# Altium schematic sheet S7CAS-PLEIADES-CARTE-MERE_P06_DDR3.SCHDOC
size Tabloid; SheetNumber: 12; SheetTotal: 18; Sheet_Name: DDR3; Size: 11x17
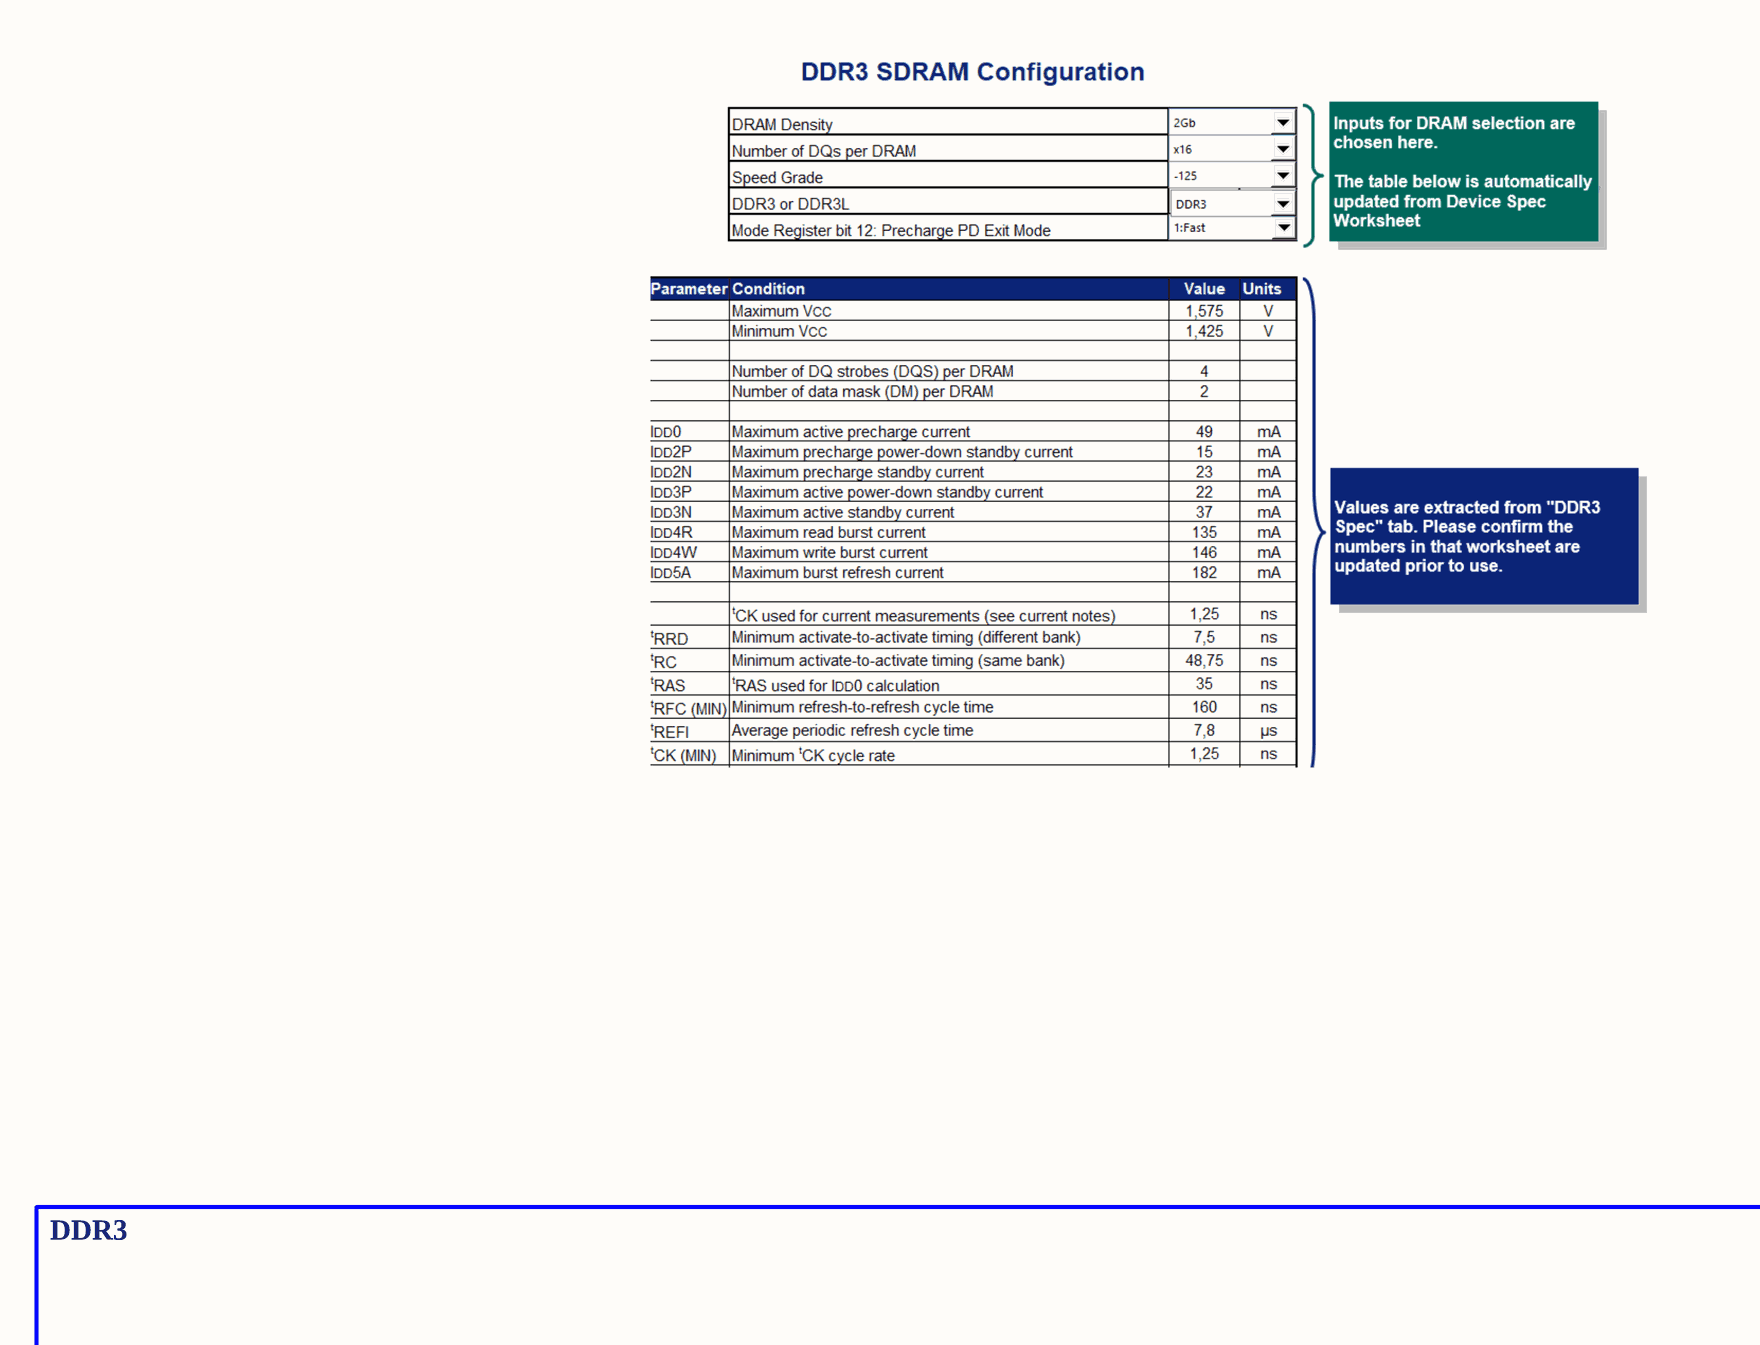
[diagram p0: S7CAS-PLEIADES-CARTE-MERE_P06_DDR3.SCHDOC, top left]
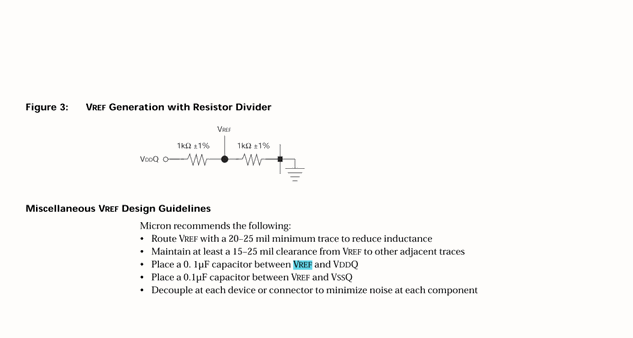
[diagram p1: S7CAS-PLEIADES-CARTE-MERE_P06_DDR3.SCHDOC, top right]
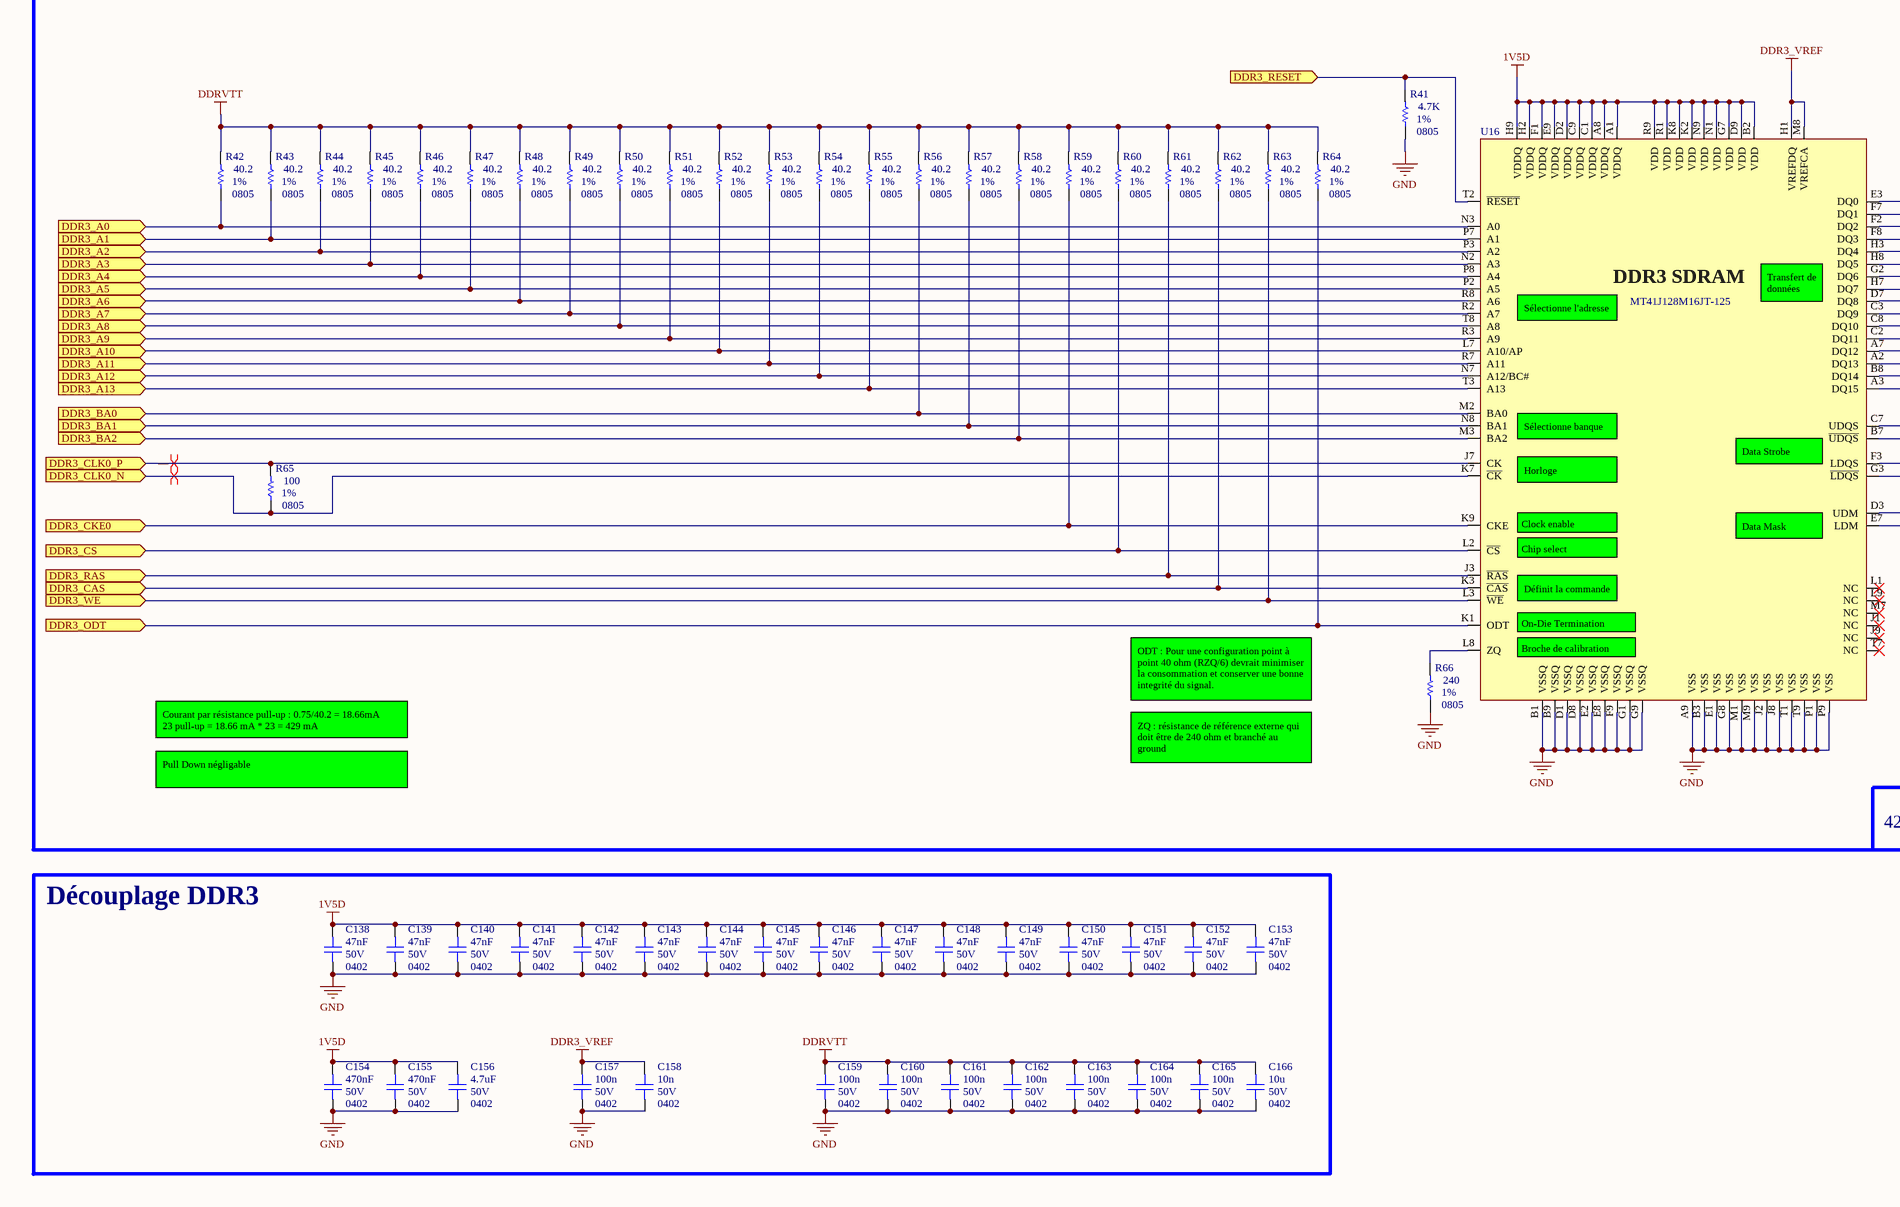
[diagram p2: S7CAS-PLEIADES-CARTE-MERE_P06_DDR3.SCHDOC, bottom left]
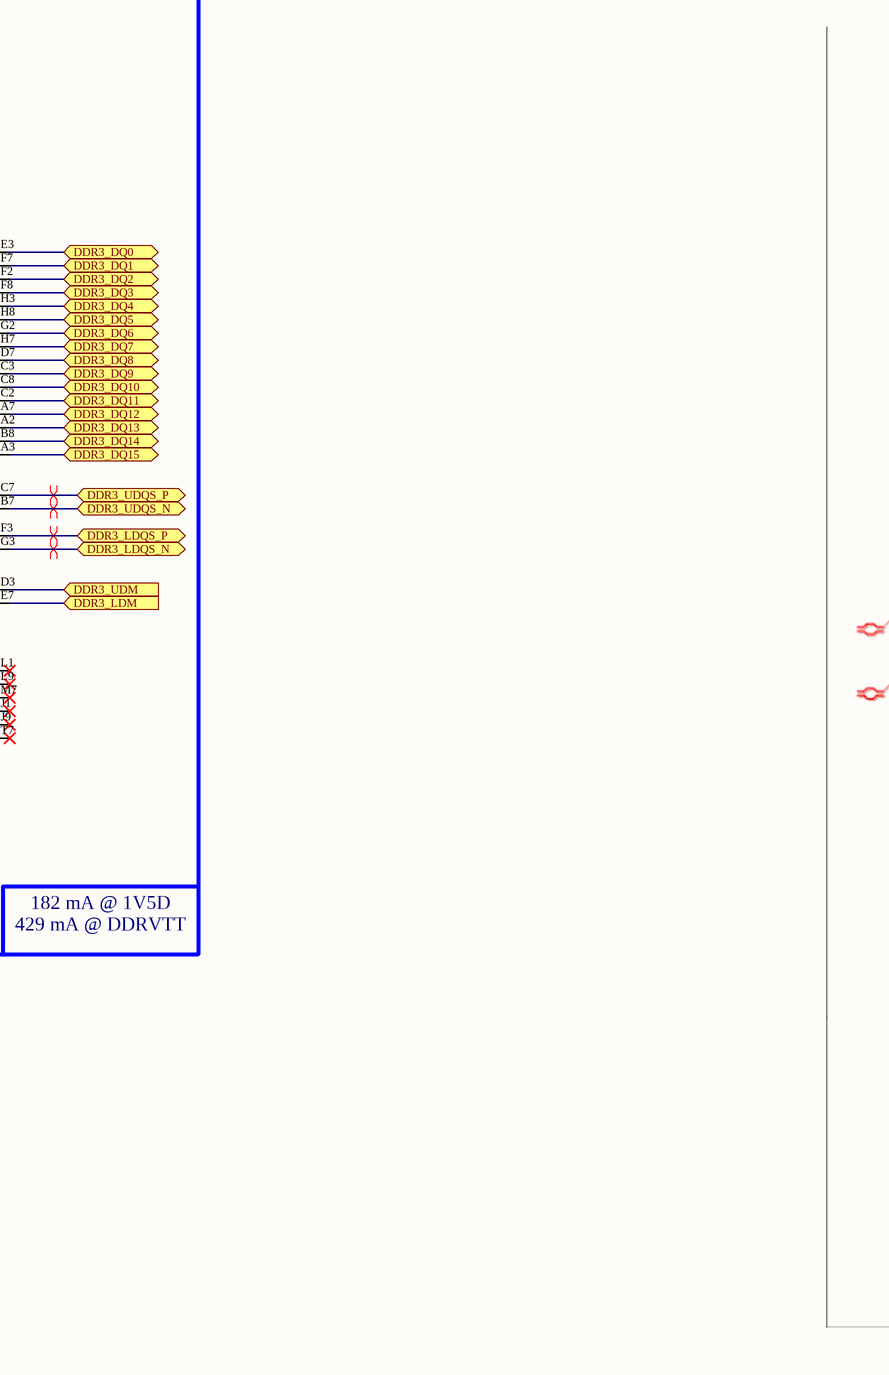
[diagram p3: S7CAS-PLEIADES-CARTE-MERE_P06_DDR3.SCHDOC, bottom middle]
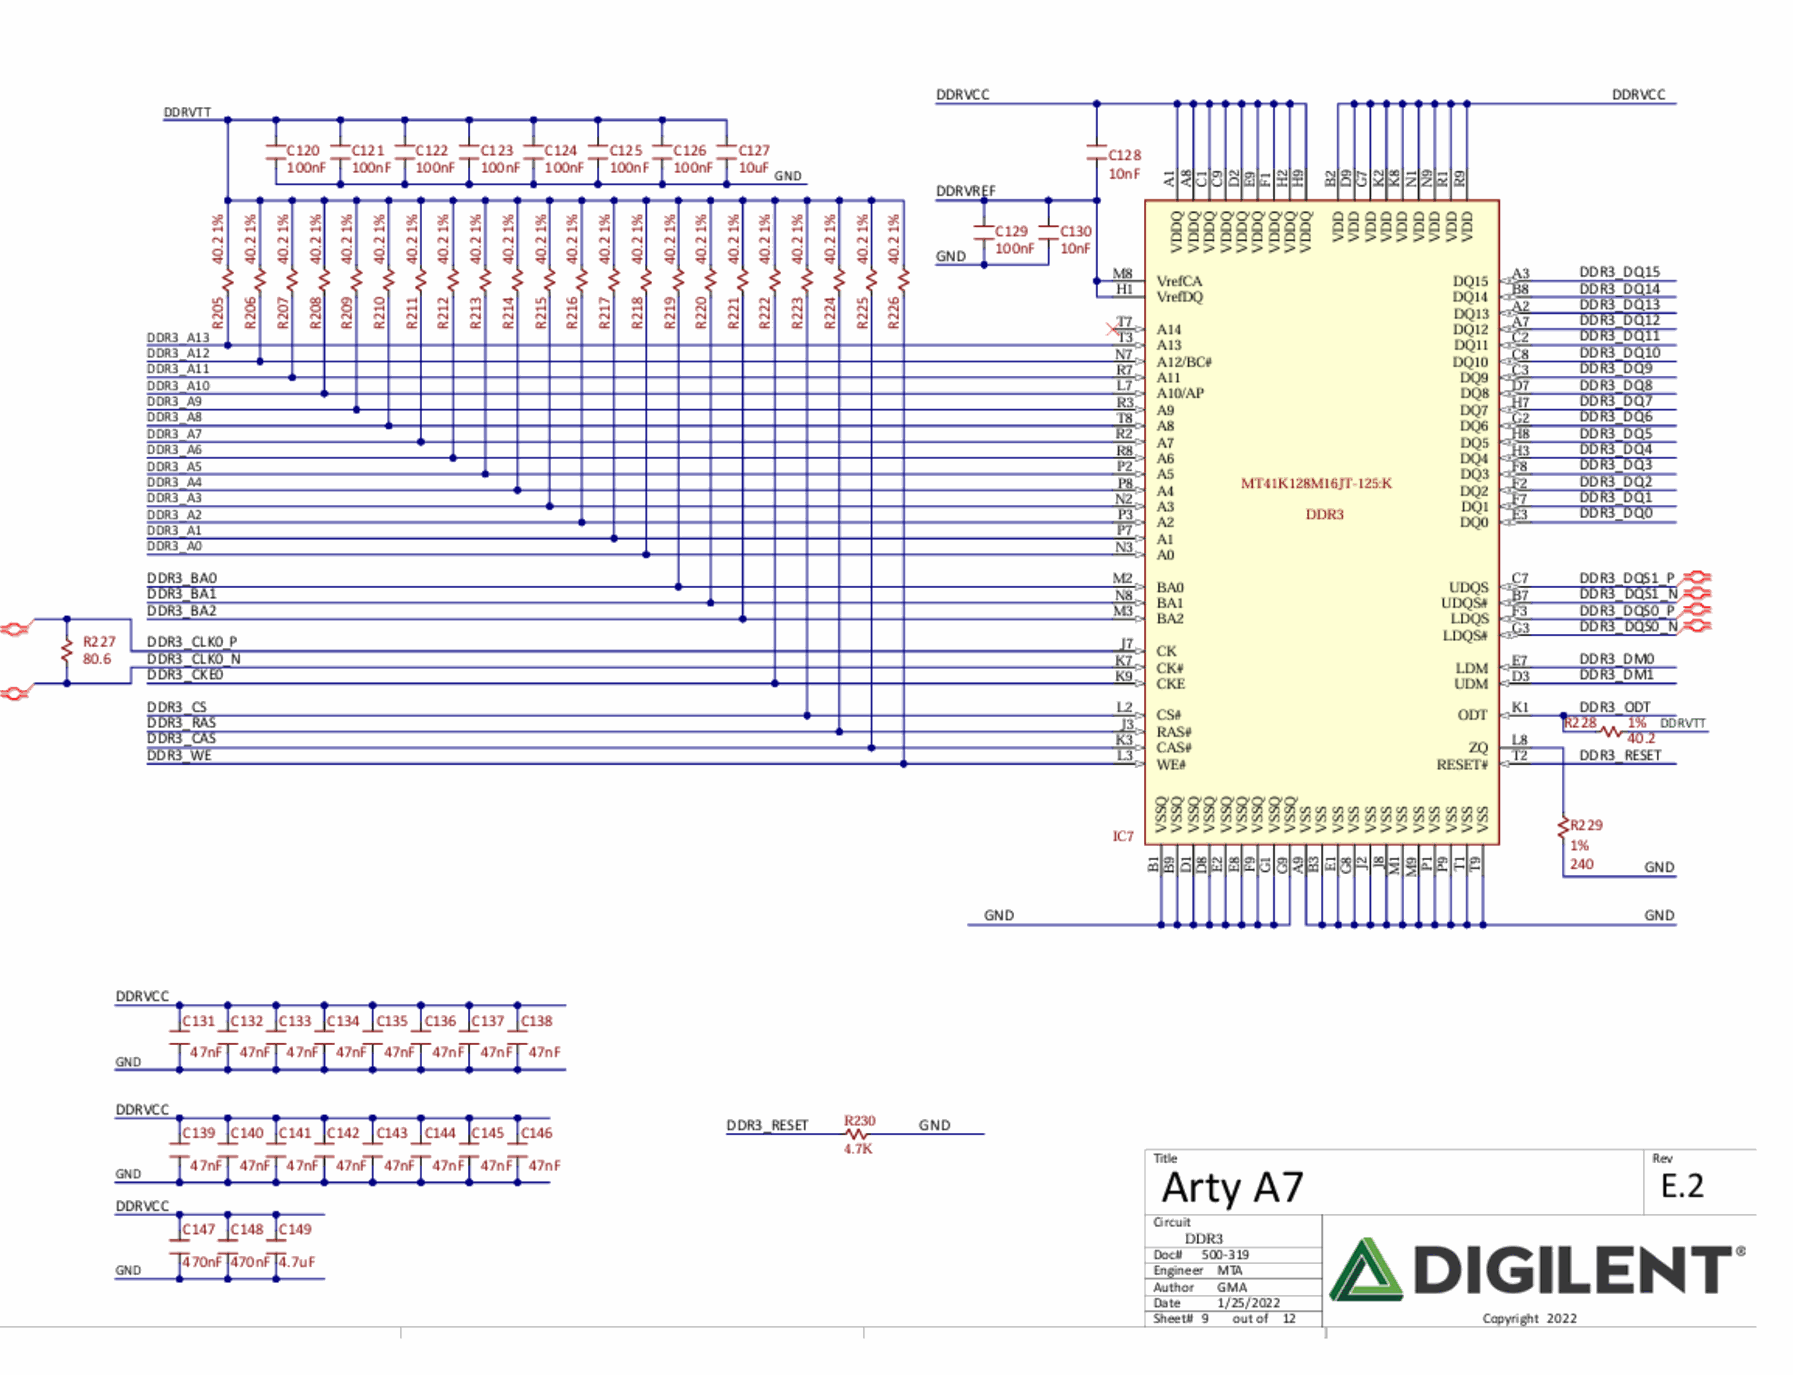
[diagram p4: S7CAS-PLEIADES-CARTE-MERE_P06_DDR3.SCHDOC, bottom right]

## Parts
C138  value 47nF  Voltage: 50V  Package: 0402  [CAP_0402]  (hidden comment: CAP - 0402)
C139  value 47nF  Voltage: 50V  Package: 0402  [CAP_0402]  (hidden comment: CAP - 0402)
C140  value 47nF  Voltage: 50V  Package: 0402  [CAP_0402]  (hidden comment: CAP - 0402)
C141  value 47nF  Voltage: 50V  Package: 0402  [CAP_0402]  (hidden comment: CAP - 0402)
C142  value 47nF  Voltage: 50V  Package: 0402  [CAP_0402]  (hidden comment: CAP - 0402)
C143  value 47nF  Voltage: 50V  Package: 0402  [CAP_0402]  (hidden comment: CAP - 0402)
C144  value 47nF  Voltage: 50V  Package: 0402  [CAP_0402]  (hidden comment: CAP - 0402)
C145  value 47nF  Voltage: 50V  Package: 0402  [CAP_0402]  (hidden comment: CAP - 0402)
C146  value 47nF  Voltage: 50V  Package: 0402  [CAP_0402]  (hidden comment: CAP - 0402)
C147  value 47nF  Voltage: 50V  Package: 0402  [CAP_0402]  (hidden comment: CAP - 0402)
C148  value 47nF  Voltage: 50V  Package: 0402  [CAP_0402]  (hidden comment: CAP - 0402)
C149  value 47nF  Voltage: 50V  Package: 0402  [CAP_0402]  (hidden comment: CAP - 0402)
C150  value 47nF  Voltage: 50V  Package: 0402  [CAP_0402]  (hidden comment: CAP - 0402)
C151  value 47nF  Voltage: 50V  Package: 0402  [CAP_0402]  (hidden comment: CAP - 0402)
C152  value 47nF  Voltage: 50V  Package: 0402  [CAP_0402]  (hidden comment: CAP - 0402)
C153  value 47nF  Voltage: 50V  Package: 0402  [CAP_0402]  (hidden comment: CAP - 0402)
C154  value 470nF  Voltage: 50V  Package: 0402  [CAP_0402]  (hidden comment: CAP - 0402)
C155  value 470nF  Voltage: 50V  Package: 0402  [CAP_0402]  (hidden comment: CAP - 0402)
C156  value 4.7uF  Voltage: 50V  Package: 0402  [CAP_0402]  (hidden comment: CAP - 0402)
C157  value 100n  Voltage: 50V  Package: 0402  [CAP_0402]  (hidden comment: CAP - 0402)
C158  value 10n  Voltage: 50V  Package: 0402  [CAP_0402]  (hidden comment: CAP - 0402)
C159  value 100n  Voltage: 50V  Package: 0402  [CAP_0402]  (hidden comment: CAP - 0402)
C160  value 100n  Voltage: 50V  Package: 0402  [CAP_0402]  (hidden comment: CAP - 0402)
C161  value 100n  Voltage: 50V  Package: 0402  [CAP_0402]  (hidden comment: CAP - 0402)
C162  value 100n  Voltage: 50V  Package: 0402  [CAP_0402]  (hidden comment: CAP - 0402)
C163  value 100n  Voltage: 50V  Package: 0402  [CAP_0402]  (hidden comment: CAP - 0402)
C164  value 100n  Voltage: 50V  Package: 0402  [CAP_0402]  (hidden comment: CAP - 0402)
C165  value 100n  Voltage: 50V  Package: 0402  [CAP_0402]  (hidden comment: CAP - 0402)
C166  value 10u  Voltage: 50V  Package: 0402  [CAP_0402]  (hidden comment: CAP - 0402)
R41  value 4.7K  Package: 0805  Precision: 1%  [RES_0805]  (hidden comment: RES - 0805)
R42  value 40.2  Package: 0805  Precision: 1%  [RES_0805]  (hidden comment: RES - 0805)
R43  value 40.2  Package: 0805  Precision: 1%  [RES_0805]  (hidden comment: RES - 0805)
R44  value 40.2  Package: 0805  Precision: 1%  [RES_0805]  (hidden comment: RES - 0805)
R45  value 40.2  Package: 0805  Precision: 1%  [RES_0805]  (hidden comment: RES - 0805)
R46  value 40.2  Package: 0805  Precision: 1%  [RES_0805]  (hidden comment: RES - 0805)
R47  value 40.2  Package: 0805  Precision: 1%  [RES_0805]  (hidden comment: RES - 0805)
R48  value 40.2  Package: 0805  Precision: 1%  [RES_0805]  (hidden comment: RES - 0805)
R49  value 40.2  Package: 0805  Precision: 1%  [RES_0805]  (hidden comment: RES - 0805)
R50  value 40.2  Package: 0805  Precision: 1%  [RES_0805]  (hidden comment: RES - 0805)
R51  value 40.2  Package: 0805  Precision: 1%  [RES_0805]  (hidden comment: RES - 0805)
R52  value 40.2  Package: 0805  Precision: 1%  [RES_0805]  (hidden comment: RES - 0805)
R53  value 40.2  Package: 0805  Precision: 1%  [RES_0805]  (hidden comment: RES - 0805)
R54  value 40.2  Package: 0805  Precision: 1%  [RES_0805]  (hidden comment: RES - 0805)
R55  value 40.2  Package: 0805  Precision: 1%  [RES_0805]  (hidden comment: RES - 0805)
R56  value 40.2  Package: 0805  Precision: 1%  [RES_0805]  (hidden comment: RES - 0805)
R57  value 40.2  Package: 0805  Precision: 1%  [RES_0805]  (hidden comment: RES - 0805)
R58  value 40.2  Package: 0805  Precision: 1%  [RES_0805]  (hidden comment: RES - 0805)
R59  value 40.2  Package: 0805  Precision: 1%  [RES_0805]  (hidden comment: RES - 0805)
R60  value 40.2  Package: 0805  Precision: 1%  [RES_0805]  (hidden comment: RES - 0805)
R61  value 40.2  Package: 0805  Precision: 1%  [RES_0805]  (hidden comment: RES - 0805)
R62  value 40.2  Package: 0805  Precision: 1%  [RES_0805]  (hidden comment: RES - 0805)
R63  value 40.2  Package: 0805  Precision: 1%  [RES_0805]  (hidden comment: RES - 0805)
R64  value 40.2  Package: 0805  Precision: 1%  [RES_0805]  (hidden comment: RES - 0805)
R65  value 100  Package: 0805  Precision: 1%  [RES_0805]  (hidden comment: RES - 0805)
R66  value 240  Package: 0805  Precision: 1%  [RES_0805]  (hidden comment: RES - 0805)
U16  MT41J128M16JT-125  [MEM_DDR3_MT41J128M16JT-125]

## Blocks framed on the sheet
DDR3: R41-R66 U16
Découplage DDR3: C138-C166

## Ports
DDR3_A0 (in, see S7CAS-PLEIADES-CARTE-MERE_P06_FPGA2[6B]), DDR3_A1 (in, see S7CAS-PLEIADES-CARTE-MERE_P06_FPGA2[6B]), DDR3_A2 (in, see S7CAS-PLEIADES-CARTE-MERE_P06_FPGA2[6B]), DDR3_A3 (in, see S7CAS-PLEIADES-CARTE-MERE_P06_FPGA2[6B]), DDR3_A4 (in, see S7CAS-PLEIADES-CARTE-MERE_P06_FPGA2[6B]), DDR3_A5 (in, see S7CAS-PLEIADES-CARTE-MERE_P06_FPGA2[6B]), DDR3_A6 (in, see S7CAS-PLEIADES-CARTE-MERE_P06_FPGA2[6B]), DDR3_A7 (in, see S7CAS-PLEIADES-CARTE-MERE_P06_FPGA2[6B]), DDR3_A8 (in, see S7CAS-PLEIADES-CARTE-MERE_P06_FPGA2[6B]), DDR3_A9 (in, see S7CAS-PLEIADES-CARTE-MERE_P06_FPGA2[6B]), DDR3_A10 (in, see S7CAS-PLEIADES-CARTE-MERE_P06_FPGA2[6B]), DDR3_A11 (in, see S7CAS-PLEIADES-CARTE-MERE_P06_FPGA2[6C]), DDR3_A12 (in, see S7CAS-PLEIADES-CARTE-MERE_P06_FPGA2[6C]), DDR3_A13 (in, see S7CAS-PLEIADES-CARTE-MERE_P06_FPGA2[6C]), DDR3_BA0 (in, see S7CAS-PLEIADES-CARTE-MERE_P06_FPGA2[6B]), DDR3_BA1 (in, see S7CAS-PLEIADES-CARTE-MERE_P06_FPGA2[6B]), DDR3_BA2 (in, see S7CAS-PLEIADES-CARTE-MERE_P06_FPGA2[6B]), DDR3_CAS (in, see S7CAS-PLEIADES-CARTE-MERE_P06_FPGA2[6B]), DDR3_CKE0 (in, see S7CAS-PLEIADES-CARTE-MERE_P06_FPGA2[6B]), DDR3_CLK0_N (in, see S7CAS-PLEIADES-CARTE-MERE_P06_FPGA2[6B]), DDR3_CLK0_P (in, see S7CAS-PLEIADES-CARTE-MERE_P06_FPGA2[6B]), DDR3_CS (in, see S7CAS-PLEIADES-CARTE-MERE_P06_FPGA2[6C]), DDR3_DQ0 (bidir, see S7CAS-PLEIADES-CARTE-MERE_P06_FPGA2[6A]), DDR3_DQ1 (bidir, see S7CAS-PLEIADES-CARTE-MERE_P06_FPGA2[6A]), DDR3_DQ2 (bidir, see S7CAS-PLEIADES-CARTE-MERE_P06_FPGA2[6A]), DDR3_DQ3 (bidir, see S7CAS-PLEIADES-CARTE-MERE_P06_FPGA2[6A]), DDR3_DQ4 (bidir, see S7CAS-PLEIADES-CARTE-MERE_P06_FPGA2[6B]), DDR3_DQ5 (bidir, see S7CAS-PLEIADES-CARTE-MERE_P06_FPGA2[6B]), DDR3_DQ6 (bidir, see S7CAS-PLEIADES-CARTE-MERE_P06_FPGA2[6B]), DDR3_DQ7 (bidir, see S7CAS-PLEIADES-CARTE-MERE_P06_FPGA2[6B]), DDR3_DQ8 (bidir, see S7CAS-PLEIADES-CARTE-MERE_P06_FPGA2[6A]), DDR3_DQ9 (bidir, see S7CAS-PLEIADES-CARTE-MERE_P06_FPGA2[6A]), DDR3_DQ10 (bidir, see S7CAS-PLEIADES-CARTE-MERE_P06_FPGA2[6A]), DDR3_DQ11 (bidir, see S7CAS-PLEIADES-CARTE-MERE_P06_FPGA2[6A]), DDR3_DQ12 (bidir, see S7CAS-PLEIADES-CARTE-MERE_P06_FPGA2[6A]), DDR3_DQ13 (bidir, see S7CAS-PLEIADES-CARTE-MERE_P06_FPGA2[6A]), DDR3_DQ14 (bidir, see S7CAS-PLEIADES-CARTE-MERE_P06_FPGA2[4C]), DDR3_DQ15 (bidir, see S7CAS-PLEIADES-CARTE-MERE_P06_FPGA2[6A]), DDR3_LDM (in, see S7CAS-PLEIADES-CARTE-MERE_P06_FPGA2[6B]), DDR3_LDQS_N (bidir, see S7CAS-PLEIADES-CARTE-MERE_P06_FPGA2[6B]), DDR3_LDQS_P (bidir, see S7CAS-PLEIADES-CARTE-MERE_P06_FPGA2[6A]), DDR3_ODT (in, see S7CAS-PLEIADES-CARTE-MERE_P06_FPGA2[6B]), DDR3_RAS (in, see S7CAS-PLEIADES-CARTE-MERE_P06_FPGA2[6B]), DDR3_RESET (in, see S7CAS-PLEIADES-CARTE-MERE_P06_FPGA2[6C]), DDR3_UDM (in, see S7CAS-PLEIADES-CARTE-MERE_P06_FPGA2[6B]), DDR3_UDQS_N (bidir, see S7CAS-PLEIADES-CARTE-MERE_P06_FPGA2[6A]), DDR3_UDQS_P (bidir, see S7CAS-PLEIADES-CARTE-MERE_P06_FPGA2[6A]), DDR3_WE (in, see S7CAS-PLEIADES-CARTE-MERE_P06_FPGA2[6B])

## Nets
1V5D: C138.2 C139.2 C140.2 C141.2 C142.2 C143.2 C144.2 C145.2 C146.2 C147.2 C148.2 C149.2 C150.2 C151.2 C152.2 C153.2 C154.2 C155.2 C156.2 U16.A1(VDDQ) U16.A8(VDDQ) U16.B2(VDD) U16.C1(VDDQ) U16.C9(VDDQ) U16.D2(VDDQ) U16.D9(VDD) U16.E9(VDDQ) U16.F1(VDDQ) U16.G7(VDD) U16.H2(VDDQ) U16.H9(VDDQ) U16.K2(VDD) U16.K8(VDD) U16.N1(VDD) U16.N9(VDD) U16.R1(VDD) U16.R9(VDD)
DDR3_VREF: C157.2 C158.2 U16.H1(VREFDQ) U16.M8(VREFCA)
DDRVTT: C159.2 C160.2 C161.2 C162.2 C163.2 C164.2 C165.2 C166.2 R42.2 R43.2 R44.2 R45.2 R46.2 R47.2 R48.2 R49.2 R50.2 R51.2 R52.2 R53.2 R54.2 R55.2 R56.2 R57.2 R58.2 R59.2 R60.2 R61.2 R62.2 R63.2 R64.2
GND: C138.1 C139.1 C140.1 C141.1 C142.1 C143.1 C144.1 C145.1 C146.1 C147.1 C148.1 C149.1 C150.1 C151.1 C152.1 C153.1 C154.1 C155.1 C156.1 C157.1 C158.1 C159.1 C160.1 C161.1 C162.1 C163.1 C164.1 C165.1 C166.1 R41.1 R66.1 U16.A9(VSS) U16.B1(VSSQ) U16.B3(VSS) U16.B9(VSSQ) U16.D1(VSSQ) U16.D8(VSSQ) U16.E1(VSS) U16.E2(VSSQ) U16.E8(VSSQ) U16.F9(VSSQ) U16.G1(VSSQ) U16.G8(VSS) U16.G9(VSSQ) U16.J2(VSS) U16.J8(VSS) U16.M1(VSS) U16.M9(VSS) U16.P1(VSS) U16.P9(VSS) U16.T1(VSS) U16.T9(VSS)
DDR3_A0: R42.1 U16.N3(A0) ; port DDR3_A0
DDR3_A1: R43.1 U16.P7(A1) ; port DDR3_A1
DDR3_A2: R44.1 U16.P3(A2) ; port DDR3_A2
DDR3_A3: R45.1 U16.N2(A3) ; port DDR3_A3
DDR3_A4: R46.1 U16.P8(A4) ; port DDR3_A4
DDR3_A5: R47.1 U16.P2(A5) ; port DDR3_A5
DDR3_A6: R48.1 U16.R8(A6) ; port DDR3_A6
DDR3_A7: R49.1 U16.R2(A7) ; port DDR3_A7
DDR3_A8: R50.1 U16.T8(A8) ; port DDR3_A8
DDR3_A9: R51.1 U16.R3(A9) ; port DDR3_A9
DDR3_A10: R52.1 U16.L7(A10/AP) ; port DDR3_A10
DDR3_A11: R53.1 U16.R7(A11) ; port DDR3_A11
DDR3_A12: R54.1 U16.N7(A12/BC#) ; port DDR3_A12
DDR3_A13: R55.1 U16.T3(A13) ; port DDR3_A13
DDR3_BA0: R56.1 U16.M2(BA0) ; port DDR3_BA0
DDR3_BA1: R57.1 U16.N8(BA1) ; port DDR3_BA1
DDR3_BA2: R58.1 U16.M3(BA2) ; port DDR3_BA2
DDR3_CAS: R62.1 U16.K3(~{CAS}) ; port DDR3_CAS
DDR3_CKE0: R59.1 U16.K9(CKE) ; port DDR3_CKE0
DDR3_CLK0_N: R65.1 U16.K7(~{CK}) ; port DDR3_CLK0_N
DDR3_CLK0_P: R65.2 U16.J7(CK) ; port DDR3_CLK0_P
DDR3_CS: R60.1 U16.L2(~{CS}) ; port DDR3_CS
DDR3_DQ0: U16.E3(DQ0) ; port DDR3_DQ0
DDR3_DQ1: U16.F7(DQ1) ; port DDR3_DQ1
DDR3_DQ2: U16.F2(DQ2) ; port DDR3_DQ2
DDR3_DQ3: U16.F8(DQ3) ; port DDR3_DQ3
DDR3_DQ4: U16.H3(DQ4) ; port DDR3_DQ4
DDR3_DQ5: U16.H8(DQ5) ; port DDR3_DQ5
DDR3_DQ6: U16.G2(DQ6) ; port DDR3_DQ6
DDR3_DQ7: U16.H7(DQ7) ; port DDR3_DQ7
DDR3_DQ8: U16.D7(DQ8) ; port DDR3_DQ8
DDR3_DQ9: U16.C3(DQ9) ; port DDR3_DQ9
DDR3_DQ10: U16.C8(DQ10) ; port DDR3_DQ10
DDR3_DQ11: U16.C2(DQ11) ; port DDR3_DQ11
DDR3_DQ12: U16.A7(DQ12) ; port DDR3_DQ12
DDR3_DQ13: U16.A2(DQ13) ; port DDR3_DQ13
DDR3_DQ14: U16.B8(DQ14) ; port DDR3_DQ14
DDR3_DQ15: U16.A3(DQ15) ; port DDR3_DQ15
DDR3_LDM: U16.E7(LDM) ; port DDR3_LDM
DDR3_LDQS_N: U16.G3(~{LDQS}) ; port DDR3_LDQS_N
DDR3_LDQS_P: U16.F3(LDQS) ; port DDR3_LDQS_P
DDR3_ODT: R64.1 U16.K1(ODT) ; port DDR3_ODT
DDR3_RAS: R61.1 U16.J3(~{RAS}) ; port DDR3_RAS
DDR3_RESET: R41.2 U16.T2(~{RESET}) ; port DDR3_RESET
DDR3_UDM: U16.D3(UDM) ; port DDR3_UDM
DDR3_UDQS_N: U16.B7(~{UDQS}) ; port DDR3_UDQS_N
DDR3_UDQS_P: U16.C7(UDQS) ; port DDR3_UDQS_P
DDR3_WE: R63.1 U16.L3(~{WE}) ; port DDR3_WE
NetR66_2: R66.2 U16.L8(ZQ)

Not connected (* = marked no-connect by the designer): U16 J1(NC)* J9(NC)* L1(NC)* L9(NC)* M7(NC)* T7(NC)*

## Layout directives
differential pair: DDR3_CLK0_N, DDR3_CLK0_P, DDR3_LDQS_N, DDR3_LDQS_P, DDR3_UDQS_N, DDR3_UDQS_P

## Notes on the sheet
- (near U16) Transfert de données
- (near U16) Sélectionne l'adresse
- (near U16) Sélectionne banque
- (near U16) Horloge
- (near U16) Data Strobe
- (near U16) Clock enable
- (near U16) Chip select
- (near U16) Data Mask
- (near U16) Définit la commande
- (near U16) On-Die Termination
- (near U16) Broche de calibration externe
- Courant par résistance pull-up : 0.75/40.2 = 18.66mA
  23 pull-up = 18.66 mA * 23 = 429 mA
- ODT : Pour une configuration point à point 40 ohm (RZQ/6) devrait minimiser la consommation et conserver une bonne integrité du signal.
- Pull Down négligable
- ZQ : résistance de référence externe qui doit être de 240 ohm et branché au ground
- 182 mA @ 1V5D
  429 mA @ DDRVTT
- Sheet Name
- Project Title
- Global Project
- Size
- Group
- Revision
- Date
- Sheet
- of
- Filename
- Designers
- (in symbol MEM_DDR3_MT41J128M16JT-125:K TR) DDR3 SDRAM

## Library data of the parts
C138-C166 = CAP - 0402: Precision: 10%; Current: *; CreatedBy: Jonathan Bouchard; Power: *
U16 = MEM_DDR3_MT41J128M16JT-125:K TR: MEM - DDR3 SDRAM 2GBIT 800MHZ - TFBGA-96; Voltage: 1.425 V ~ 1.575 V; Mfg: Micrel; Current: *; Power: *; Mfg Part Number: MT41J128M16JT-125; HelpURL: http://www.micron.com/~/media/Documents/Products/Data%20Sheet/DRAM/DDR3/2Gb_DDR3_SDRAM.pdf; CreatedBy: Jonathan Bouchard; Temperature: 0°C ~ 95°C (TC); Value: *; Precision: *; Package: TFBGA-96; Supplier 1: Digikey; Supplier Part Number 1: 557-1611-1-ND
R41-R66 = RES - 0805: Current: *; CreatedBy: Jonathan Bouchard